# Altium schematic sheet 电源.SchDoc
size A4
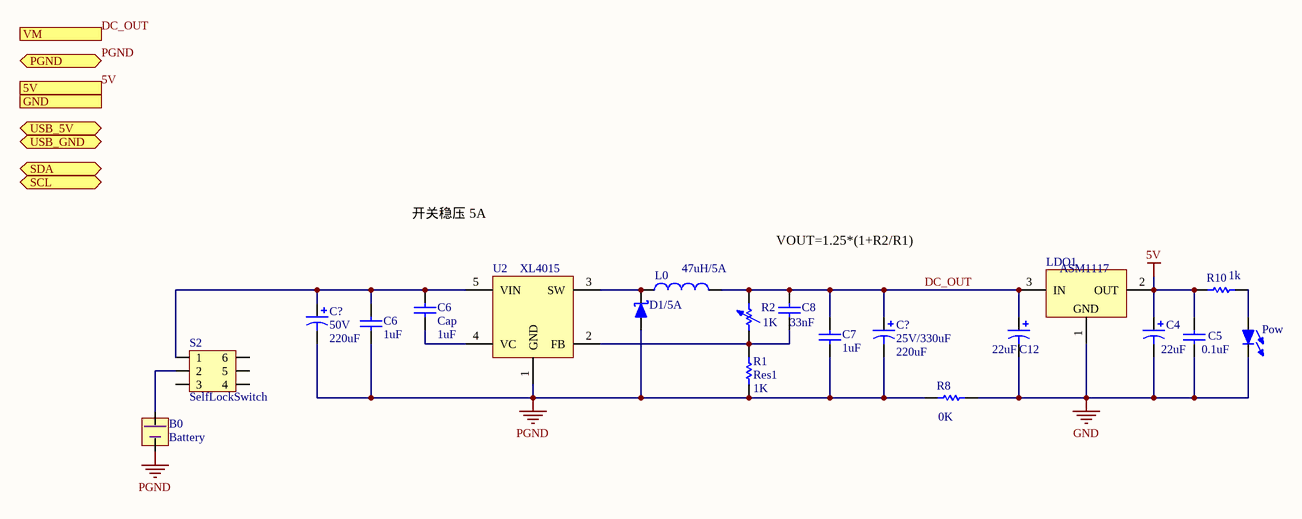
[diagram p0: 电源.SchDoc]

## Parts
(Parts that share a designator on the sheet are numbered #1, #2 ... from top to bottom, then left to right.)
B0  Battery  [LI]
C4  value 22uF  [LC-CASE-B_3528]  (hidden comment: Cap Pol3)
C5  value 0.1uF  [6-0805_N]  (hidden comment: Cap)
C6#1  Cap  value 1uF  [6-0805_N]
C6#2  value 1uF  [6-0805_N]  (hidden comment: Cap)
C7  value 1uF  [6-0805_N]  (hidden comment: Cap)
C8  value 33nF  [6-0805_N]  (hidden comment: Cap)
C12  value 22uF  [LC-CASE-B_3528]  (hidden comment: Cap Pol3)
C?#1  50V  value 220uF  [RB7.6-15]
C?#2  25V/330uF  value 220uF  [RB7.6-15]
D1/5A  Diode-Schottky  [Diode-Schottky]  (value not drawn)
L0  value 47uH/5A  [0402-A]  (hidden comment: Inductor)
LDO1  ASM1117  [SOT-223]
Pow  LED  [LED_0805]  (value not drawn)
R1  Res1  value 1K  [AXIAL-0.3]
R2  value 1K  [AXIAL-0.7]  (hidden comment: Res Adj1)
R8  value 0K  [AXIAL-0.3]  (hidden comment: Res1)
R10  value 1k  [6-0805_N]  (hidden comment: Res1)
S2  SelfLockSwitch  [KEY_ZS_5.8*5.8]
U2  XL4015

## Ports
5V (out), GND, PGND, SCL, SDA, USB_5V (in), USB_GND, VM (out)

## Nets
5V: C4.1 C5.2 LDO1.2(OUT) R10.2 ; port 5V
GND: C4.2 C5.1 C12.2 LDO1.1 Pow.2 R8.2
PGND: B0.2 C6#2.1 C7.1 C?#1.2 C?#2.2 D1/5A.1 R1.1 R8.1 U2.1(GND) ; port PGND
DC_OUT: C7.2 C8.2 C12.1 C?#2.1 L0.2 LDO1.3(IN) R2.2 ; port VM
NetB0_1: B0.1(+) S2.2
NetC6#1_1: C6#1.1 U2.4(VC)
NetC6#1_2: C6#1.2 C6#2.2 C?#1.1 S2.1 U2.5(VIN)
NetC8_1: C8.1 R1.2 R2.1 U2.2(FB)
NetD1/5A_2: D1/5A.2 L0.1 U2.3(SW)
NetPow_1: Pow.1 R10.1

Not connected (* = marked no-connect by the designer): S2 3 4 5 6

## Notes on the sheet
- 开关稳压 5A
- VOUT=1.25*(1+R2/R1)
- (in symbol ASM1117) GND

## Library data of the parts
B0 = Battery: 电池
C4 C12 = Cap Pol3: Polarized Capacitor (Surface Mount); Published: 8-Jun-2000; LatestRevisionDate: 29-May-2009; LatestRevisionNote: IPC-7351 Footprint Added.; PackageReference: C0805; Publisher: Altium Limited; PackageDescription: Chip Capacitor
C5 C6#1 C6#2 C7 C8 = Cap: Capacitor; Published: 8-Jun-2000; LatestRevisionDate: 17-Jul-2002; LatestRevisionNote: Re-released for DXP Platform.; PackageReference: RAD-0.3; Publisher: Altium Limited; PackageDescription: Radial Cap, Thru-Hole; 2 Leads; 0.3 in Pin Spacing
C?#1 C?#2 = Cap Pol1: Polarized Capacitor (Radial); Published: 8-Jun-2000; LatestRevisionDate: 17-Jul-2002; LatestRevisionNote: Re-released for DXP Platform.; PackageReference: RB7.6-15; Publisher: Altium Limited; PackageDescription: Polarized Capacitor (Radial); 2 Leads
L0 = Inductor: Code_IEC: 1005; Published: 8-Jun-2000; LatestRevisionDate: 29-May-2009; LatestRevisionNote: IPC-7351 Footprint Added.; PackageReference: 0402-A; Publisher: Altium Limited; PackageDescription: Chip Inductor; Code_JEITA: 0402
LDO1 = ASM1117: 线性稳压
R1 R8 R10 = Res1: Resistor; Published: 8-Jun-2000; LatestRevisionDate: 17-Jul-2002; LatestRevisionNote: Re-released for DXP Platform.; PackageReference: AXIAL-0.3; Publisher: Altium Limited; PackageDescription: Axial Device, Thru-Hole; 2 Leads; 0.3 in Pin Spacing
R2 = Res Adj1: Variable Resistor; Set Position: 0.5; Published: 8-Jun-2000; LatestRevisionDate: 17-Jul-2002; LatestRevisionNote: Re-released for DXP Platform.; PackageReference: AXIAL-0.7; Publisher: Altium Limited; PackageDescription: Axial Device, Thru-Hole; 2 Leads; 0.7 in Pin Spacing
U2 = XL4015: 开关降压型 DC-DC 转换芯片 最大5A 输出